# EAGLE design sbusToPWM (EAGLE 5.11)
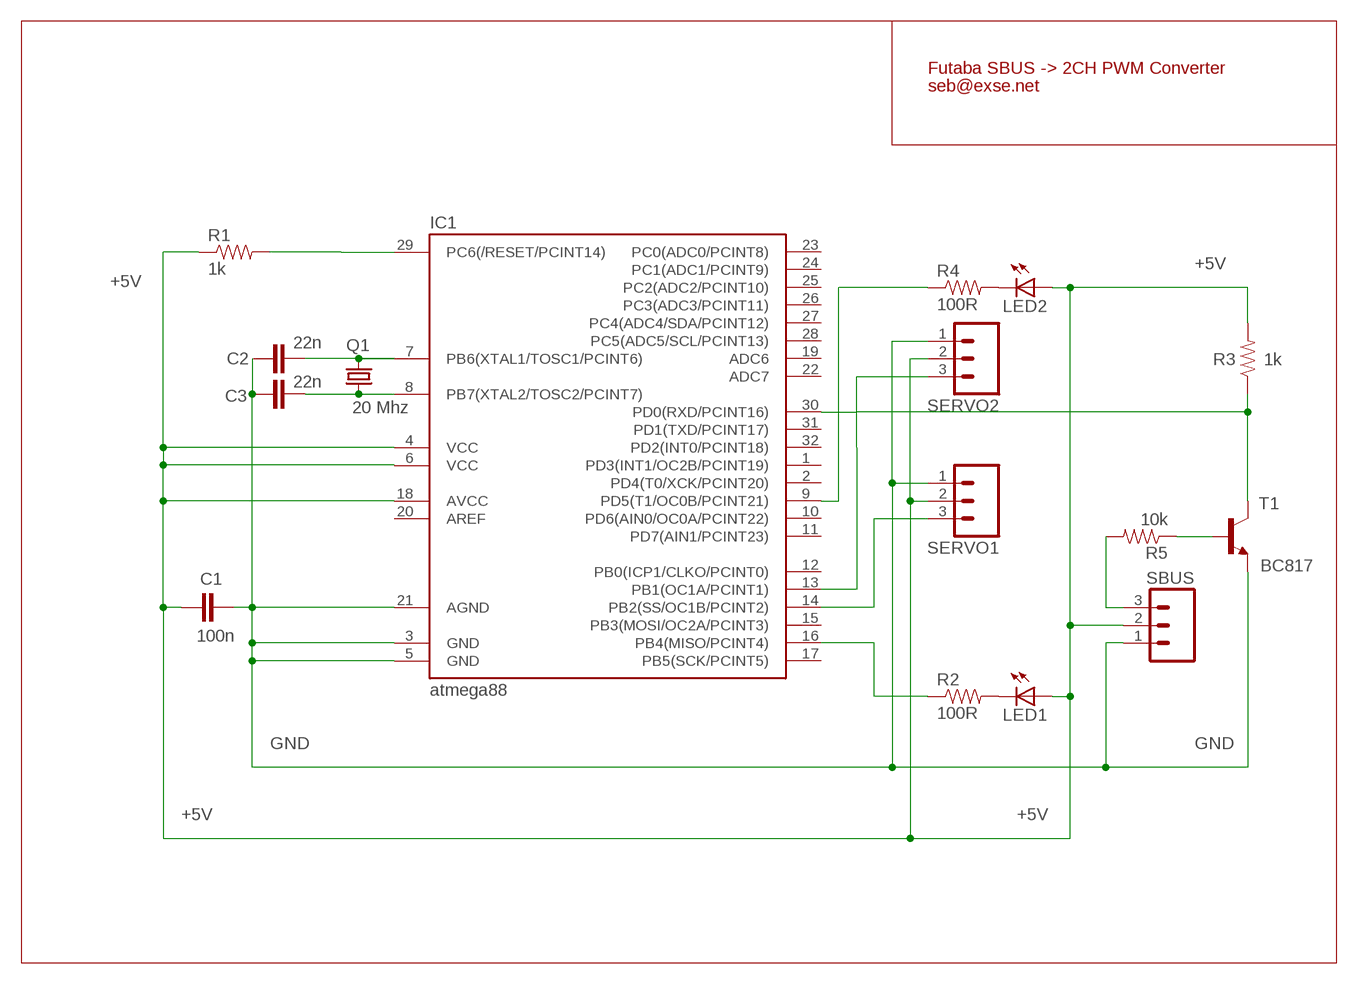
[diagram p0: schematic, sheet 1]

## Parts
C1  100n  CAP0805  [0805]
C2  22n  CAP0805  [0805]
C3  22n  CAP0805  [0805]
IC1  atmega88  MEGA48/88/168-AU  [TQFP32-08]
LED1  LEDCHIPLED_0805  [CHIPLED_0805]
LED2  LEDCHIPLED_0805  [CHIPLED_0805]
Q1  20 Mhz  X22-OSCILLATOR  [X22]
R1  1k  RESISTOR  [0805]
R2  100R  RESISTOR  [0805]
R3  1k  RESISTOR  [0805]
R4  100R  RESISTOR  [0805]
R5  10k  RESISTOR  [0805]
SBUS  M03LONGPADS  [1X03_LONGPADS]
SERVO1  M03LONGPADS  [1X03_LONGPADS]
SERVO2  M03LONGPADS  [1X03_LONGPADS]
T1  BC817  BC847  [SOT23]

## Nets
+5V: C1.1 IC1.4(VCC) IC1.6(VCC) IC1.18(AVCC) LED1.A LED2.A R1.1 R3.2 SBUS.2 SERVO1.2 SERVO2.2
GND: C1.2 C2.1 C3.1 IC1.3(GND) IC1.5(GND) IC1.21(AGND) SBUS.1 SERVO1.1 SERVO2.1 T1.2(E)
N$1: LED1.C R2.2
N$2: IC1.13(PB1(OC1A/PCINT1)) SERVO2.3
N$3: IC1.16(PB4(MISO/PCINT4)) R2.1
N$4: IC1.14(PB2(SS/OC1B/PCINT2)) SERVO1.3
N$5: R5.2 SBUS.3
N$8: IC1.29(PC6(/RESET/PCINT14)) R1.2
N$9: C3.2 IC1.8(PB7(XTAL2/TOSC2/PCINT7)) Q1.1
N$10: C2.2 IC1.7(PB6(XTAL1/TOSC1/PCINT6)) Q1.3
N$11: R5.1 T1.1(B)
N$14: LED2.C R4.2
N$15: IC1.9(PD5(T1/OC0B/PCINT21)) R4.1
N$16: IC1.30(PD0(RXD/PCINT16)) R3.1 T1.3(C)
Unconnected: IC1.1(PD3(INT1/OC2B/PCINT19)) IC1.2(PD4(T0/XCK/PCINT20)) IC1.10(PD6(AIN0/OC0A/PCINT22)) IC1.11(PD7(AIN1/PCINT23)) IC1.12(PB0(ICP1/CLKO/PCINT0)) IC1.15(PB3(MOSI/OC2A/PCINT3)) IC1.17(PB5(SCK/PCINT5)) IC1.19(ADC6) IC1.20(AREF) IC1.22(ADC7) IC1.23(PC0(ADC0/PCINT8)) IC1.24(PC1(ADC1/PCINT9)) IC1.25(PC2(ADC2/PCINT10)) IC1.26(PC3(ADC3/PCINT11)) IC1.27(PC4(ADC4/SDA/PCINT12)) IC1.28(PC5(ADC5/SCL/PCINT13)) IC1.31(PD1(TXD/PCINT17)) IC1.32(PD2(INT0/PCINT18))

## Notes on the sheet
- Futaba SBUS -> 2CH PWM Converter
- seb@exse.net

## Library data of the parts
C1-C3 = SparkFun:CAP: Capacitor Standard 0603 ceramic capacitor, and 0.1" leaded capacitor.
IC1 = avr-4:MEGA48/88/168
LED1 LED2 = led:LED: LED OSRAM: - CHIPLED LG R971, LG N971, LY N971, LG Q971, LY Q971, LO R971, LY R971 LH N974, LH R974 LS Q976, LO Q976, LY Q976 LO Q996 - Hyper CHIPLED LW Q18S LB Q993, LB Q99A, LB R99A - SideLED LS A670, LO A670, LY A670, LG A670, LP A670 LB A673, LV A673, LT A673, LW A673 LH A674 LY A675 LS A676, LA A676, LO A676, LY A676, LW A676 LS A679, LY A679, LG A679 - Hyper Micro SIDELED® LS Y876, LA Y876, LO Y876, LY Y876 LT Y87S - SmartLED LW L88C, LW L88S LB L89C, LB L89S, LG L890 LS L89K, LO L89K, LY L89K LS L896, LA L896, LO L896, LY L896 - TOPLED LS T670, LO T670, LY T670, LG T670, LP T670 LSG T670, LSP T670, LSY T670, LOP T670, LYG T670 LG T671, LOG T671, LSG T671 LB T673, LV T673, LT T673, LW T673 LH T674 LS T676, LA T676, LO T676, LY T676, LB T676, LH T676, LSB T676, LW T676 LB T67C, LV T67C, LT T67C, LS T67K, LO T67K, LY T67K, LW E67C LS E67B, LA E67B, LO E67B, LY E67B, LB E67C, LV E67C, LT E67C LW T67C LS T679, LY T679, LG T679 LS T770, LO T770, LY T770, LG T770, LP T770 LB T773, LV T773, LT T773, LW T773 LH T774 LS E675, LA E675, LY E675, LS T675 LS T776, LA T776, LO T776, LY T776, LB T776 LHGB T686 LT T68C, LB T68C - Hyper Mini TOPLED® LB M676 - Mini TOPLED Santana® LG M470 LS M47K, LO M47K, LY M47K Source: http://www.osram.convergy.de LUXEON: - LUMILED® LXK2-PW12-R00, LXK2-PW12-S00, LXK2-PW14-U00, LXK2-PW14-V00 LXK2-PM12-R00, LXK2-PM12-S00, LXK2-PM14-U00 LXK2-PE12-Q00, LXK2-PE12-R00, LXK2-PE12-S00, LXK2-PE14-T00, LXK2-PE14-U00 LXK2-PB12-K00, LXK2-PB12-L00, LXK2-PB12-M00, LXK2-PB14-N00, LXK2-PB14-P00, LXK2-PB14-Q00 LXK2-PR12-L00, LXK2-PR12-M00, LXK2-PR14-Q00, LXK2-PR14-R00 LXK2-PD12-Q00, LXK2-PD12-R00, LXK2-PD12-S00 LXK2-PH12-R00, LXK2-PH12-S00 LXK2-PL12-P00, LXK2-PL12-Q00, LXK2-PL12-R00 Source: www.luxeon.com KINGBRIGHT: KA-3528ASYC Source: www.kingbright.com
Q1 = seb:X22-OSCILLATOR
R1-R5 = SparkFun:RESISTOR: Resistor Basic schematic elements and footprints for 0603, 1206, and PTH 1/10th watt (small) resistors.
SBUS SERVO1 SERVO2 = SparkFun:M03: Header 3 Standard 3-pin 0.1" header. Use with straight break away headers (SKU : PRT-00116), right angle break away headers (PRT-00553), swiss pins (PRT-00743), machine pins (PRT-00117), and female headers (PRT-00115). Molex polarized connector foot print use with SKU : PRT-08232 with associated crimp pins and housings.
T1 = transistor:BC847: NPN TRANSISTOR

## Board
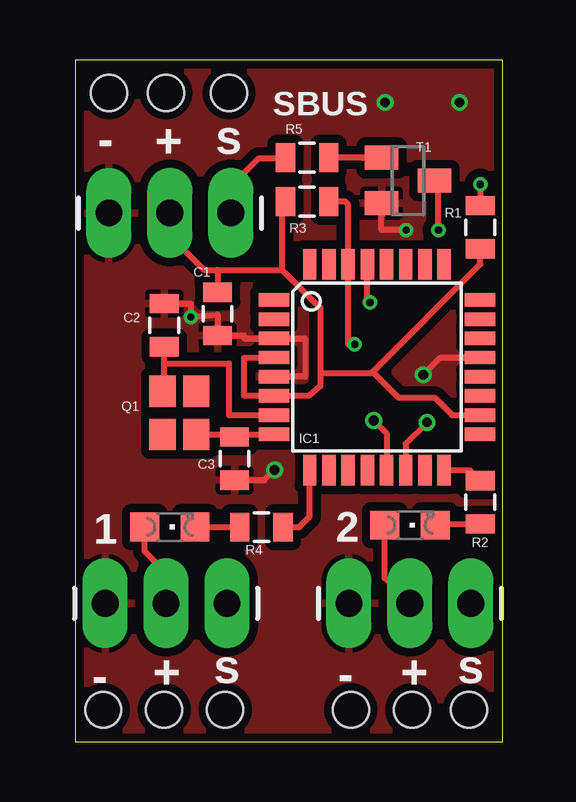
[diagram p1: board, top side]
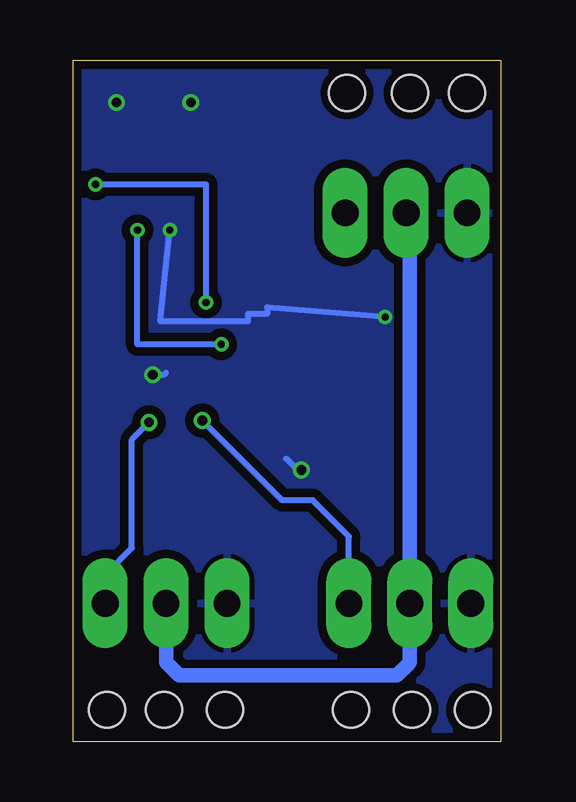
[diagram p2: board, bottom side, seen from below]

Size 17.82 x 28.42 mm. Coordinates in mm from the lower left corner, seen from the top.
Outline: 0,0 17.82,0 17.82,28.42 0,28.42 0,0
Copper layers (1*16): Top 0.035mm / dielectric 1.5mm / Bottom 0.035mm
Design rules "PCB-POOL Standard *": minimum track width 0.15mm, minimum drill 0.3mm, track to track 0.15mm, track to pad 0.15mm, pad to pad 0.15mm, via to via 0.15mm, smd to smd 0.15mm, copper to edge 0.1mm, drill to drill 0.2mm, minimum pad ring 0.2mm, minimum via ring 0.15mm, stop-mask expansion 0.075mm, vias tented up to drill 30mil, thermal gap 0.2mm
Holes 1.5 mm at 1.17,1.33 3.71,1.33 6.25,1.33 11.49,1.33 16.41,1.33 1.41,27.04 3.79,27.04 6.41,27.04 14.03,1.33

### Footprints (pad centres in the part's own frame; a part is rotated, then mirrored left to right if it is on the bottom)
0805 = smd 0.8 x 1.2: 1 -0.9,0; 2 0.9,0
TQFP32-08 = smd 1.27 x 0.559: 1 -4.293,2.8; 2 -4.293,2; 3 -4.293,1.2; 4 -4.293,0.4; 5 -4.293,-0.4; 6 -4.293,-1.2; 7 -4.293,-2; 8 -4.293,-2.8; 17 4.293,-2.8; 18 4.293,-2; 19 4.293,-1.2; 20 4.293,-0.4; 21 4.293,0.4; 22 4.293,1.2; 23 4.293,2; 24 4.293,2.8 | smd 0.559 x 1.27: 9 -2.8,-4.293; 10 -2,-4.293; 11 -1.2,-4.293; 12 -0.4,-4.293; 13 0.4,-4.293; 14 1.2,-4.293; 15 2,-4.293; 16 2.8,-4.293; 25 2.8,4.293; 26 2,4.293; 27 1.2,4.293; 28 0.4,4.293; 29 -0.4,4.293; 30 -1.2,4.293; 31 -2,4.293; 32 -2.8,4.293
CHIPLED_0805 = smd 1.2 x 1.2: A 0,-1.05; C 0,1.05
X22 = smd 1.3 x 1.1: 1 0.9,0.7; 2 -0.9,0.7; 3 -0.9,-0.7; 4 0.9,-0.7
1X03_LONGPADS = drill 1.118 pad 1.88 long: 1 0,0; 2 2.54,0; 3 5.08,0
SOT23 = smd 1 x 1.4: 1 -0.95,-1.1; 2 0.95,-1.1; 3 0,1.1

### Placement (x,y rotation side)
C1  5.93,17.84 270 top
C2  3.71,17.36 270 top
C3  6.64,11.8 90 top
IC1  12.57,15.61 0 top
LED1  13.95,9.03 270 top
LED2  3.95,8.95 270 top
Q1  4.34,13.71 270 top
R1  16.88,21.44 90 top
R2  16.88,9.98 270 top
R3  9.66,22.52 180 top
R4  7.76,8.95 180 top
R5  9.66,24.35 180 top
SBUS  1.41,22.04 0 top
SERVO1  11.41,5.77 0 top
SERVO2  1.25,5.77 0 top
T1  13.87,23.39 270 top

### Tracks (layer width: path | path; a pad name or v marks a point on that pad's centre or on a via)
+5V
  Top 0.254: R1.1 16.88,19.91 12.4,15.42 | IC1.4 7.04,16.02 7.04,14.41 IC1.6 9.74,14.41 10.21,14.82 10.21,15.38 | 3.95,21.09 5.38,19.66 5.93,19.66 | 5.93,19.66 8.63,19.66 | 8.63,19.66 10.21,18.08 10.21,15.38 | C1.1 | 5.93,19.66 C1.1 | R3.2 8.63,22.39 8.63,19.66 | 12.4,15.42 12.35,15.38 10.21,15.38 | IC1.18 15.71,13.61 14.98,14.34 13.47,14.34 12.4,15.42 | LED2.A 2.9,7.93 3.79,7.04 SERVO2.2 | SERVO1.2 12.9,6.82 LED1.A
  Top 0.406: SBUS.2 3.95,21.09
  Bottom 0.61: SBUS.2 3.79,21.89 SERVO2.2 3.79,3.31 3.87,3.23 4.34,2.76 13.39,2.76 13.95,3.31 SERVO1.2
GND  (via drill 0.3, 0.4)
  Top 0.254: IC1.5 9.58,15.21 9.58,16.81 IC1.3 7.04,16.81 7.04,16.94 C1.2 5.93,17.81 v4.82,17.71 4.82,18.26 | T1.2 12.76,21.33 v13.79,21.33 | IC1.21 15.22,16.02 v14.5,15.3 | C3.1 7.89,10.91 v8.31,11.33 | 4.5,18.26 4.82,18.26 | 4.5,18.26 4.82,18.26 | 4.5,18.26 4.82,18.26 | C2.1 4.5,18.26
  Bottom 0.254: v13.79,21.33 14.19,17.52 10.53,17.52 10.53,17.84 9.74,17.84 9.74,18.1 v4.82,17.71 | v14.5,15.3 14.03,15.3 13.95,15.38 | v8.31,11.33 8.47,11.33 8.95,11.8
  other vias: 16.01,26.65 12.92,26.65
  pour Bottom (isolate 0.35): 0.06,28.47 17.84,28.47 17.84,-0.26 0.06,-0.26
  pour Top (isolate 0.35): 0.06,28.47 17.84,28.47 17.84,-0.26 0.06,-0.26
N$1
  Top 0.254: LED1.C 15.05,9.08 R2.2
N$2  (via drill 0.4)
  Top 0.254: v12.44,13.39 12.97,12.86 IC1.13
  Bottom 0.254: SERVO2.3 6.33,7.28 6.33,8.55 7.84,10.06 9.11,10.06 v12.44,13.39
N$3
  Top 0.254: R2.1 16.44,11.32 IC1.16
N$4  (via drill 0.4)
  Top 0.254: v14.66,13.31 13.77,12.42 IC1.14
  Bottom 0.254: SERVO1.3 16.49,6.96 15.38,8.07 15.38,12.6 v14.66,13.31
N$5
  Top 0.254: R5.2 8.76,24.32 7.65,24.32 6.49,23.15 SBUS.3
N$8  (via drill 0.3)
  Top 0.254: v16.88,23.23 R1.2 | v12.28,18.31 12.17,18.31 IC1.29
  Bottom 0.254: v12.28,18.31 12.28,23.23 v16.88,23.23
N$9
  Top 0.254: 6.64,12.81 C3.2 | 6.64,12.81 IC1.8 | Q1.1 5.2,12.81 6.64,12.81
N$10
  Top 0.254: Q1.3 3.71,14.13 3.71,15.77 | IC1.7 6.41,13.61 6.41,15.77 3.71,15.77 | 3.71,15.77 C2.2
N$11
  Top 0.254: R5.1 11.97,24.35 T1.1
N$14
  Top 0.254: LED2.C | LED2.C R4.2
N$15
  Top 0.254: R4.1 9.34,8.95 9.74,9.34 9.77,9.38 IC1.9
N$16  (via drill 0.3)
  Top 0.254: T1.3 15.14,23.31 v15.14,21.33 | v11.65,16.57 11.37,16.57 IC1.30 11.37,22.4 11.25,22.52 R3.1 | R3.1
  Bottom 0.254: v15.14,21.33 15.14,16.57 v11.65,16.57

### Text on the board
tPlace: SBUS | - | + | s | 2 | 1 | s | s | - | + | - | +
bStop: seb@exse.net | SBUS TO PPM